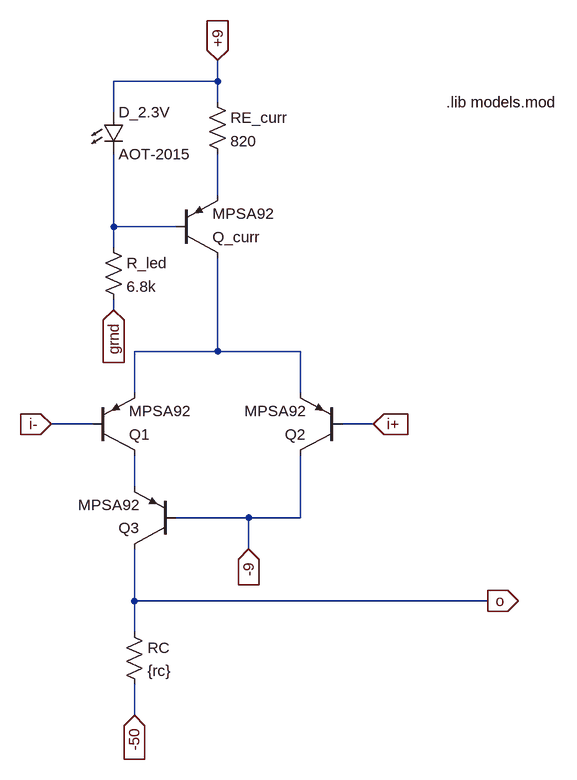
[diagram p0: schematic ss-par-pnp.asc]
ss-par-pnp.asc, the LTspice schematic file:
Version 4
SHEET 1 1328 856
WIRE -48 -224 -48 -256
WIRE -48 -224 -208 -224
WIRE -48 -192 -48 -224
WIRE -208 -176 -208 -224
WIRE -48 -48 -48 -112
WIRE -208 0 -208 -112
WIRE -112 0 -208 0
WIRE -208 32 -208 0
WIRE -208 128 -208 112
WIRE -48 192 -48 48
WIRE -48 192 -176 192
WIRE 80 192 -48 192
WIRE -176 256 -176 192
WIRE 80 256 80 192
WIRE -240 304 -304 304
WIRE 192 304 144 304
WIRE -176 400 -176 352
WIRE 0 448 -112 448
WIRE 80 448 80 352
WIRE 80 448 0 448
WIRE 0 496 0 448
WIRE -176 576 -176 496
WIRE 368 576 -176 576
WIRE -176 624 -176 576
WIRE -176 752 -176 704
FLAG -48 -256 +9
IOPIN -48 -256 In
FLAG 0 496 -9
IOPIN 0 496 In
FLAG -176 752 -50
IOPIN -176 752 In
FLAG -304 304 i-
IOPIN -304 304 In
FLAG 192 304 i+
IOPIN 192 304 In
FLAG 368 576 o
IOPIN 368 576 Out
FLAG -208 128 grnd
IOPIN -208 128 In
DATAFLAG -208 0 "round($*10)/10"
DATAFLAG -48 192 "round($*1k)/1k"
DATAFLAG -176 576 "round($*100)/100"
SYMBOL res -64 -208 R0
SYMATTR InstName RE_curr
SYMATTR Value 820
SYMBOL rui\\shortcuts\\pnp -112 48 M180
SYMATTR InstName Q_curr
SYMATTR Value MPSA92
SYMBOL rui\\shortcuts\\pnp -240 352 M180
SYMATTR InstName Q1
SYMATTR Value MPSA92
SYMBOL rui\\shortcuts\\pnp -112 496 R180
SYMATTR InstName Q3
SYMATTR Value MPSA92
SYMBOL res -192 608 R0
SYMATTR InstName RC
SYMATTR Value {rc}
SYMBOL rui\\shortcuts\\pnp 144 352 R180
SYMATTR InstName Q2
SYMATTR Value MPSA92
SYMBOL LED -224 -176 R0
SYMATTR InstName D_2.3V
SYMATTR Value AOT-2015
SYMBOL res -224 16 R0
SYMATTR InstName R_led
SYMATTR Value 6.8k
TEXT 304 -192 Left 2 !.lib models.mod

The netlist it stands for:
* ss-par-pnp.asc
RE_curr +9 N001 820
Q_curr N003 N002 N001 0 MPSA92
Q1 N004 i- N003 0 MPSA92
Q3 o -9 N004 0 MPSA92
RC o -50 {rc}
Q2 -9 i+ N003 0 MPSA92
D_2.3V +9 N002 AOT-2015
R_led N002 grnd 6.8k
.model D D
.lib standard.dio
.model NPN NPN
.model PNP PNP
.lib standard.bjt
.lib models.mod
.backanno
.end